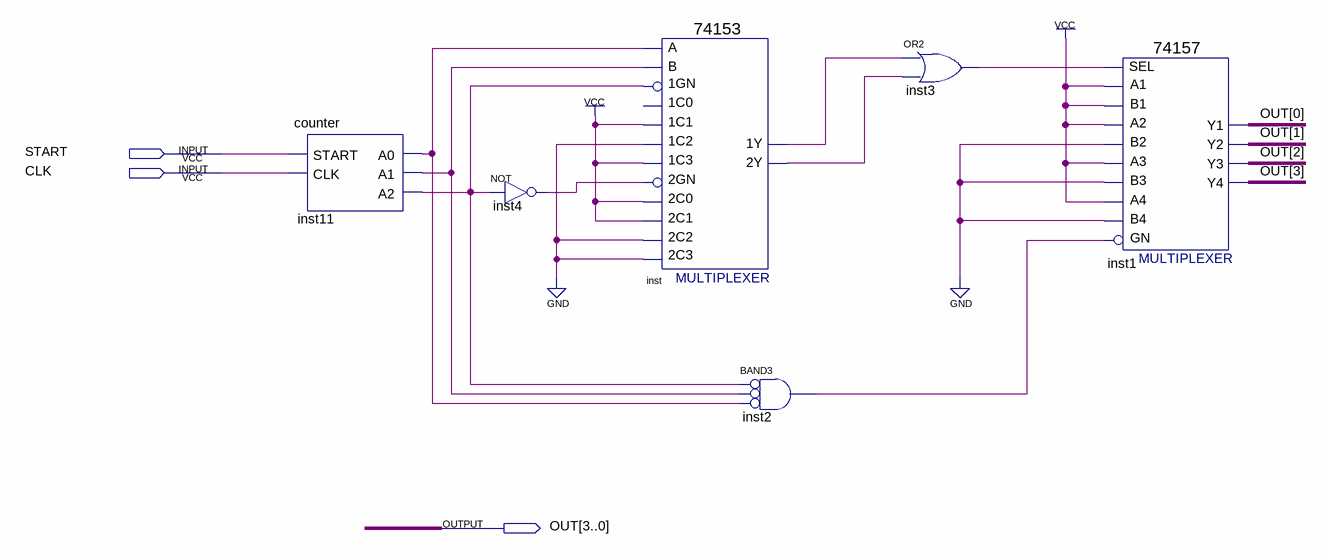
[diagram p0: schematic sheet]
// Quartus schematic generator1.bdf as structural Verilog: 6 symbols, 3 pins
module generator1 (
  input  START,
  input  CLK,
  output [3:0] OUT
);

  wire inst2_out, inst3_out, inst4_out, inst11_a0, inst11_a1, inst11_a2, inst_1y, inst_2y;

  counter inst11 (.START(START), .CLK(CLK), .A0(inst11_a0), .A1(inst11_a1), .A2(inst11_a2));
  not inst4 (inst4_out, inst11_a2);
  \74153  inst (
    .\1C1 (1'b1), .\1GN (inst11_a2), .\2C0 (1'b1), .\2GN (inst4_out), .\2C2 (1'b0), .\1C2 (1'b0),
    .\1C3 (1'b1), .B(inst11_a1), .A(inst11_a0), .\2C1 (1'b1), .\2C3 (1'b0), .\1Y (inst_1y), .\2Y (inst_2y));  // open: 1C0
  and inst2 (inst2_out, ~inst11_a2, ~inst11_a1, ~inst11_a0);  // BAND3
  or inst3 (inst3_out, inst_1y, inst_2y);
  \74157  inst1 (
    .A1(1'b1), .B1(1'b1), .SEL(inst3_out), .B2(1'b0), .A3(1'b1), .B3(1'b0), .A2(1'b1), .B4(1'b0),
    .GN(inst2_out), .A4(1'b1), .Y2(OUT[1]), .Y1(OUT[0]), .Y4(OUT[3]), .Y3(OUT[2]));
endmodule
